# Altium schematic sheet [09] - SENSOR.SchDoc
size A3; DocumentNumber: 9; SheetNumber: 9; SheetTotal: 10
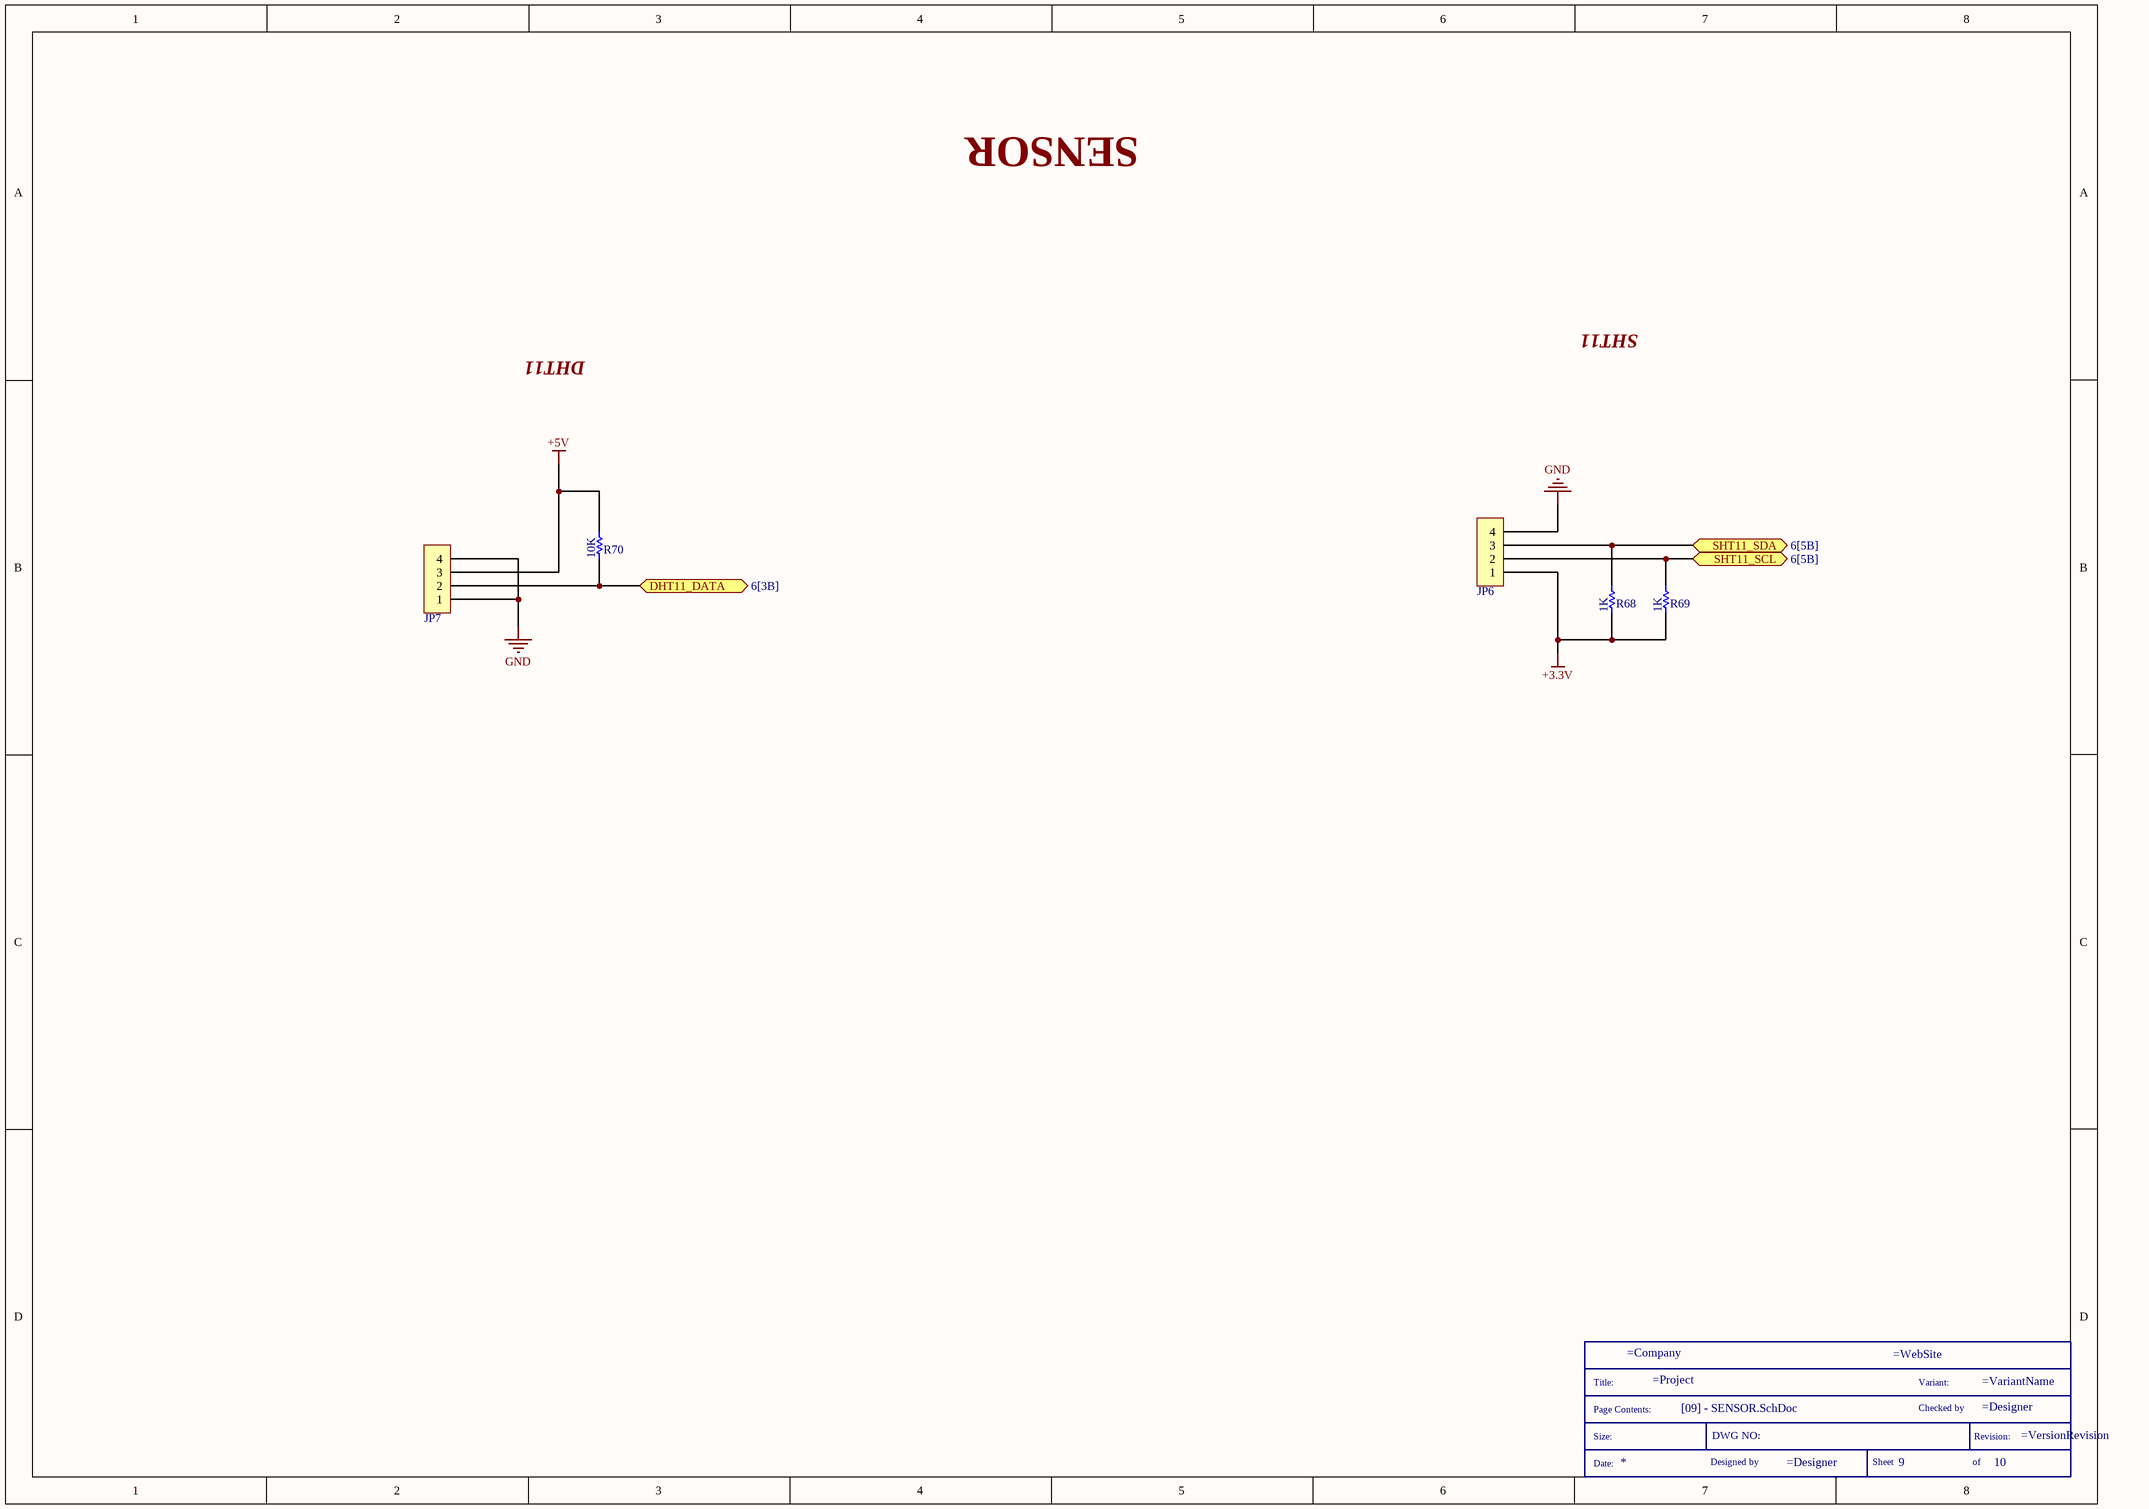
[diagram p0: [09] - SENSOR.SchDoc]

## Parts
*  SCH_TITLE  (value not drawn)  (graphical)
JP6  HDR FEMALE 1X4 2.54MM  [HDR_FEMALE_1X4_2.54MM]  (value not drawn)
JP7  HDR FEMALE 1X4 2.54MM  [HDR_FEMALE_1X4_2.54MM]  (value not drawn)
R68  1K  [RES_0805]
R69  1K  [RES_0805]
R70  10K  [RES_0805]

## Ports
DHT11_DATA (see 6[3B]), SHT11_SCL (see 6[5B]), SHT11_SDA (see 6[5B])

## Nets
+3.3V: JP6.1 R68.2 R69.2
+5V: JP7.3 R70.2
GND: JP6.4 JP7.1 JP7.4
DHT11_DATA: JP7.2 R70.1 ; port DHT11_DATA
SHT11_SCL: JP6.2 R69.1 ; port SHT11_SCL
SHT11_SDA: JP6.3 R68.1 ; port SHT11_SDA

## Notes on the sheet
- SENSOR
- DHT11
- SHT11
- (in symbol SCH_TITLE) Title:; Variant:; Page Contents:; Checked by; Size:; DWG NO:; Revision:; Date:; Designed by; Sheet; of

## Library data of the parts
* = SCH_TITLE: Schematic information
JP6 JP7 = PPTC041LFBN-RC: Manufacturer 1: Sullins Connector Solutions; Category: Rectangular Connectors - Headers, Receptacles, Female Sockets; Case/Package: 4POS_2.54mmPitch; Manufacturer Part Number 1: PPTC041LFBN-RC; Quantity: 1; Supplier 1: Digikey; Supplier Part Number 1: S7002-ND; Supplier Order Qty 1: 1; Supplier Stock 1: 30769; Supplier Unit Price 1: 0,45; Supplier Currency 1: $
R68 R69 = ERJ-6ENF1001V: RES SMD 1K OHM; Manufacturer 1: Panasonic Electronic Components; Category: Chip Resistor - Surface Mount; Manufacturer Part Number 1: ERJ-6ENF1001V; Case/Package: 0805 (2012 Metric); Quantity: 1; Supplier 1: Digikey; Supplier Part Number 1: P1.00KCCT-ND; Supplier Order Qty 1: 1; Supplier Stock 1: 1361018; Supplier Unit Price 1: 0,1; Supplier Currency 1: $
R70 = ERJ-6ENF1002V: RES SMD 10K OHM 1% 1/8W 0805; Manufacturer 1: Panasonic Electronic Components; Category: Chip Resistor - Surface Mount; Manufacturer Part Number 1: ERJ-6ENF1002V; Case/Package: 0805 (2012 Metric); Quantity: 1; Supplier 1: Digikey; Supplier Part Number 1: P10.0KCCT-ND; Supplier Order Qty 1: 1; Supplier Stock 1: 2515107; Supplier Unit Price 1: 0,1; Supplier Currency 1: $